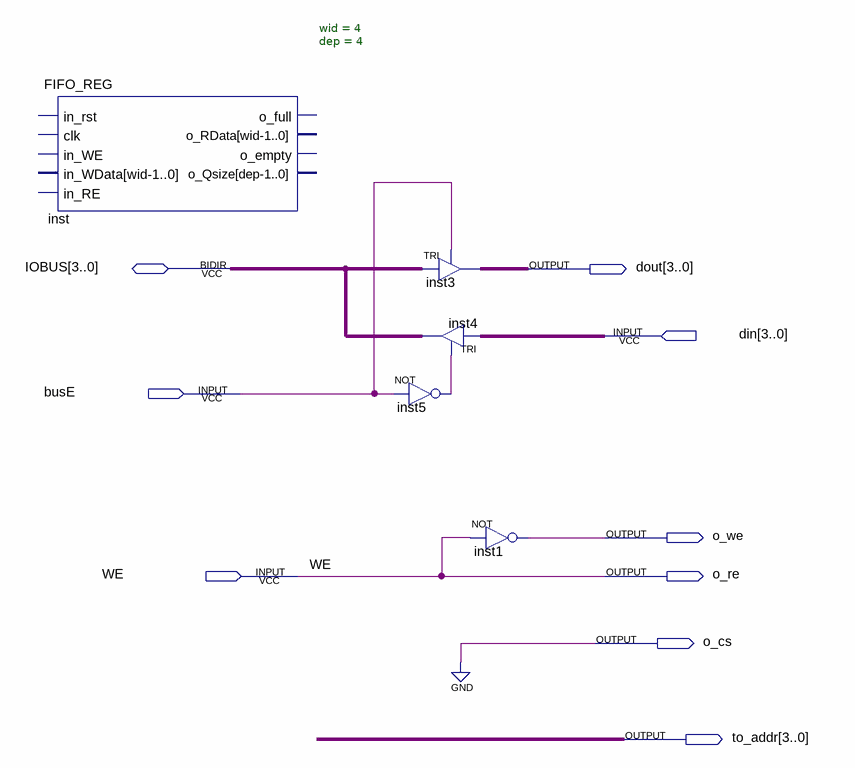
[diagram p0: schematic sheet]
// Quartus schematic FIFO_62256.bdf as structural Verilog: 5 symbols, 9 pins
module FIFO_62256 (
  input  [3:0] din,
  input  busE,
  input  WE,
  inout  [3:0] IOBUS,
  output [3:0] dout,
  output o_we,
  output o_re,
  output o_cs,
  output [3:0] to_addr
);

  wire inst5_out;

  FIFO_REG #(.wid(4), .dep(4)) inst ();  // open: in_rst, clk, in_WE, in_WData, in_RE, o_full, o_RData, o_empty, o_Qsize
  TRI inst3[3:0] (.IN(IOBUS), .OE(busE), .OUT(dout));
  TRI inst4[3:0] (.IN(din), .OE(inst5_out), .OUT(IOBUS));
  not inst5 (inst5_out, busE);
  not inst1 (o_we, WE);

  assign o_cs = 1'b0;
  assign o_re = WE;
endmodule
